# Altium schematic sheet USB.SchDoc: Ixora
size A3; Organization: Toradex AG; Address1: Altsagenstrasse 5; Address2: Horw; Address3: 6048; Address4: Switzerland; DocumentNumber: 6; Revision: V1.1; SheetNumber: 8; SheetTotal: 17; PageSetup: Record=PageOptions|CenterHorizontal=True|CenterVertical=True|PrintScale=0.73|XCorrection=1.00|YCorrection=1.00|PrintKind=0|BorderSize=5000000|LeftOffset=0|BottomOffset=0|Orientation=2|PaperLength=1000|PaperWidth=1000|Scale=100|PaperSource=7|PrintQuality=-4|MediaType=1|DitherType=10|PaperKind=A4|PrintScaleMode=1
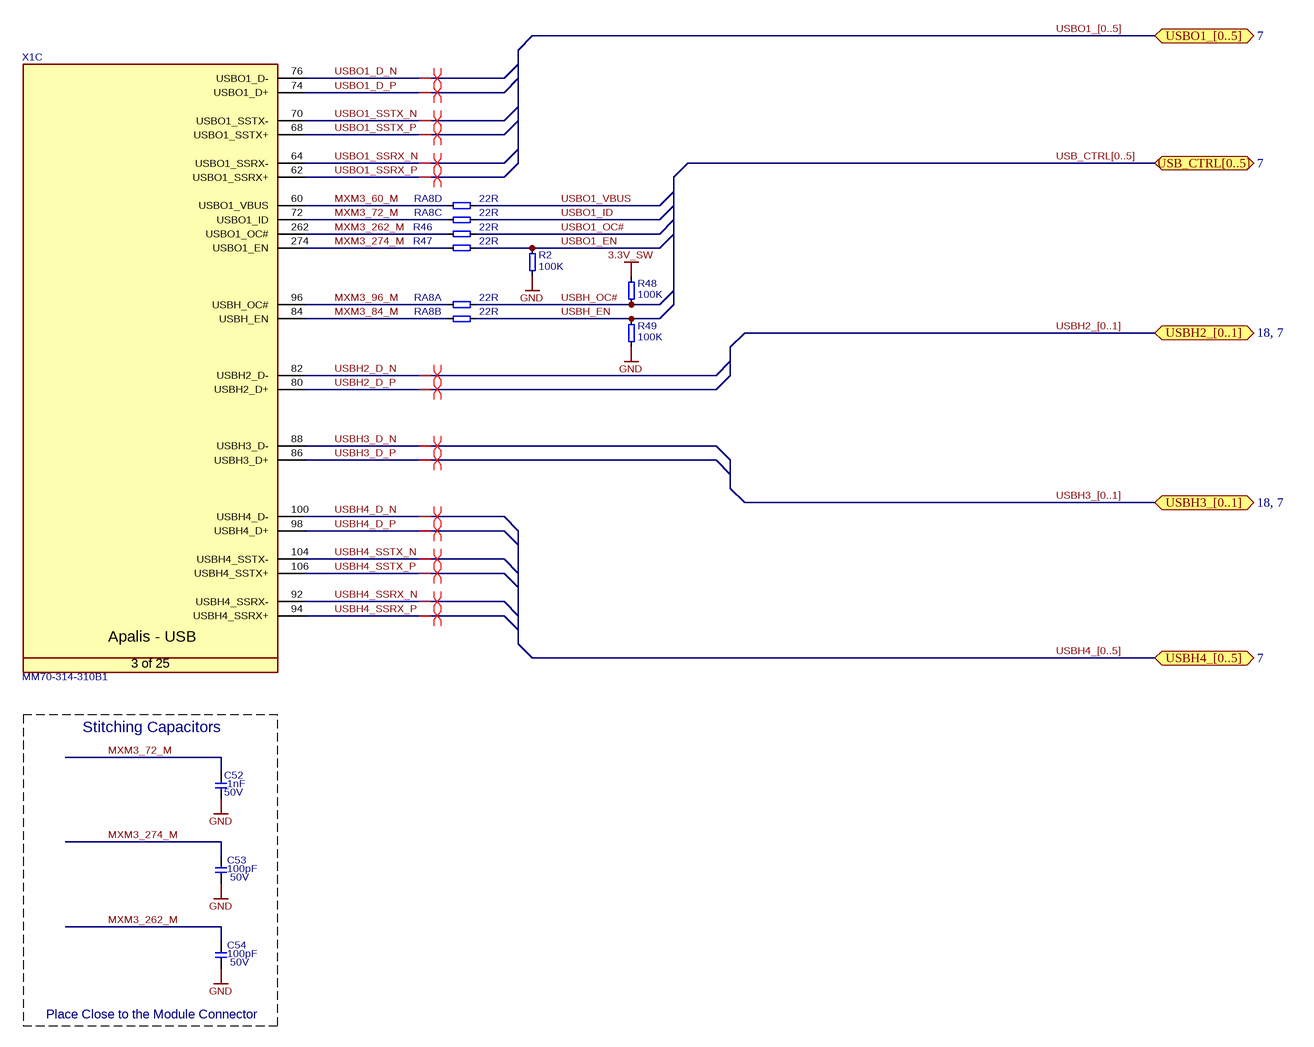
[diagram p0: USB.SchDoc]

## Parts
C52  Rating: 50V  [CAPC1005X60N]  (hidden comment: 1nF)
C53  Rating: 50V  [CAPC1005X60N]  (hidden comment: 100pF)
C54  Rating: 50V  [CAPC1005X60N]  (hidden comment: 100pF)
R2  100K  [RESC1005X40N]
R46  22R  [RESC1005X40N]
R47  22R  [RESC1005X40N]
R48  100K  [RESC1005X40N]
R49  100K  [RESC1005X40N]
RA8  22R  [T_Resistor_Array_X4]  (parts A,B,C,D of 4)
X1  Manufacturer Part No.: MM70-314-310B1  [T_JAE_MM70-314-310B1]  (hidden comment: CON-JAE-MM70-314-310B1-314-0.5mm)  (part C of 25)

## Blocks framed on the sheet
Stitching Capacitors: C52-C54

## Ports
USB_CTRL[0..5] (bidir, see 7), USBH2_[0..1] (bidir, see 18, 7), USBH3_[0..1] (bidir, see 18, 7), USBH4_[0..5] (bidir, see 7), USBO1_[0..5] (bidir, see 7)

## Nets
3.3V_SW: R48.1
GND: C52.1 C53.1 C54.1 R2.1 R49.1
MXM3_60_M: RA8.4 X1.60(USBO1_VBUS)
MXM3_72_M: C52.2 RA8.3 X1.72(USBO1_ID)
MXM3_84_M: RA8.2 X1.84(USBH_EN)
MXM3_96_M: RA8.1 X1.96(USBH_OC#)
MXM3_262_M: C54.2 R46.1 X1.262(USBO1_OC#)
MXM3_274_M: C53.2 R47.1 X1.274(USBO1_EN)
USBH2_D_N: X1.82(USBH2_D-)
USBH2_D_P: X1.80(USBH2_D+)
USBH3_D_N: X1.88(USBH3_D-)
USBH3_D_P: X1.86(USBH3_D+)
USBH4_D_N: X1.100(USBH4_D-)
USBH4_D_P: X1.98(USBH4_D+)
USBH4_SSRX_N: X1.92(USBH4_SSRX-)
USBH4_SSRX_P: X1.94(USBH4_SSRX+)
USBH4_SSTX_N: X1.104(USBH4_SSTX-)
USBH4_SSTX_P: X1.106(USBH4_SSTX+)
USBH_EN: R49.2 RA8.6
USBH_OC#: R48.2 RA8.5
USBO1_D_N: X1.76(USBO1_D-)
USBO1_D_P: X1.74(USBO1_D+)
USBO1_EN: R2.2 R47.2
USBO1_ID: RA8.7
USBO1_OC#: R46.2
USBO1_SSRX_N: X1.64(USBO1_SSRX-)
USBO1_SSRX_P: X1.62(USBO1_SSRX+)
USBO1_SSTX_N: X1.70(USBO1_SSTX-)
USBO1_SSTX_P: X1.68(USBO1_SSTX+)
USBO1_VBUS: RA8.8

## Buses and harness runs
bus USB_CTRL[0..5] = port USB_CTRL[0..5]
bus USBH2_[0..1] = port USBH2_[0..1]
bus USBH3_[0..1] = port USBH3_[0..1]
bus USBH4_[0..5] = port USBH4_[0..5]
bus USBO1_[0..5] = port USBO1_[0..5]

## Layout directives
differential pair: USBH2_D_N, USBH2_D_P, USBH3_D_N, USBH3_D_P, USBH4_D_N, USBH4_D_P, USBH4_SSRX_N, USBH4_SSRX_P, USBH4_SSTX_N, USBH4_SSTX_P, USBO1_D_N, USBO1_D_P, USBO1_SSRX_N, USBO1_SSRX_P, USBO1_SSTX_N, USBO1_SSTX_P

## Notes on the sheet
- (near C54) Place Close to the Module Connector
- Title
- Size:
- Date:
- A3
- Number:
- Time:
- Revision:
- Sheet
- of
- File:
- (in symbol CON-JAE-MM70-314-310B1-314-0.5mm, part C) Apalis - USB; 3 of 25

## Library data of the parts
C52 = C-X7R-1nF-50V-10%-0402: Capacitor Ceramic X7R 1nF 50V 10% 0402; Tolerance: 10%; Type: X7R; Value: 1nF
C53 C54 = C-X7R-100pF-50V-10%-0402: Capacitor Ceramic X7R 100pF 50V 10% 0402; Tolerance: 10%; Type: X7R; Value: 100pF
R2 R48 R49 = R-100KR-63mW-5%-0402: Resistor 100 Kohm 63mW 5% 0402; Value: 100KR; Rating: 63mW; Tolerance: 5%
R46 R47 = R-22R-63mW-5%-0402: Resistor 22 ohm 63mW 5% 0402; Rating: 63mW; Tolerance: 5%; Value: 22R
RA8 = RA-22R-63mW-5%-1206-div: Resistor Array 22 R 63mW 5% 1206; Tolerance: 5%; Power Dissipation: 63mW; Value: 22R
X1 = CON-JAE-MM70-314-310B1-314-0.5mm: MXM3 Connector; Manufacturer Name: JAE; No. of ways: 314